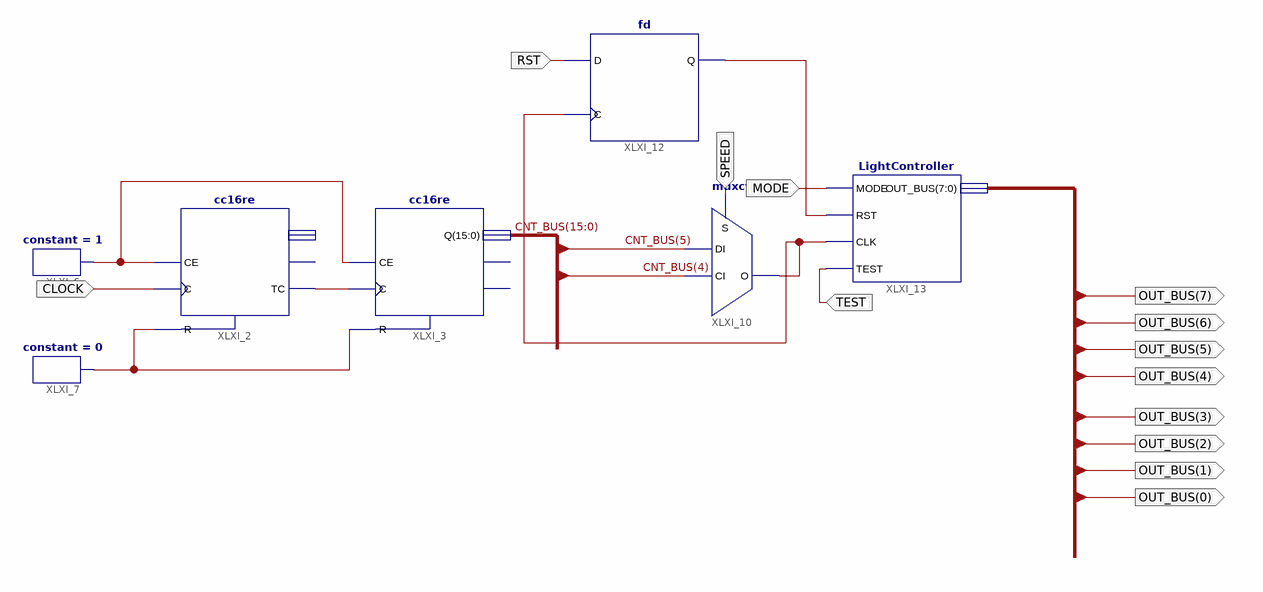
[diagram p0: schematic sheet 1]
// Xilinx ISE schematic TopLevel.sch (spartan3a) as structural Verilog: 7 symbols, 13 ports
module TopLevel (
  input  CLOCK,
  input  MODE,
  input  SPEED,
  input  RST,
  input  TEST,
  output [7:0] OUT_BUS
);

  wire XLXN_1, XLXN_5, XLXN_12, XLXN_23, XLXN_24;
  wire [15:0] CNT_BUS;

  cc16re XLXI_2 (.C(CLOCK), .CE(XLXN_12), .R(XLXN_5), .TC(XLXN_1));  // open: CEO, Q
  cc16re XLXI_3 (.C(XLXN_1), .CE(XLXN_12), .R(XLXN_5), .Q(CNT_BUS));  // open: CEO, TC
  constant #(.CValue("1")) XLXI_6 (.O(XLXN_12));
  constant #(.CValue("0")) XLXI_7 (.O(XLXN_5));
  muxcy XLXI_10 (.CI(CNT_BUS[4]), .DI(CNT_BUS[5]), .S(SPEED), .O(XLXN_23));
  fd XLXI_12 (.C(XLXN_23), .D(RST), .Q(XLXN_24));
  LightController XLXI_13 (.MODE(MODE), .CLK(XLXN_23), .RST(XLXN_24), .OUT_BUS(OUT_BUS), .TEST(TEST));
endmodule
